# Altium schematic sheet STRWL-S02-V00-12VProtection.SchDoc: 12V Protected Input
size A3; SheetNumber: 2; SheetTotal: 7
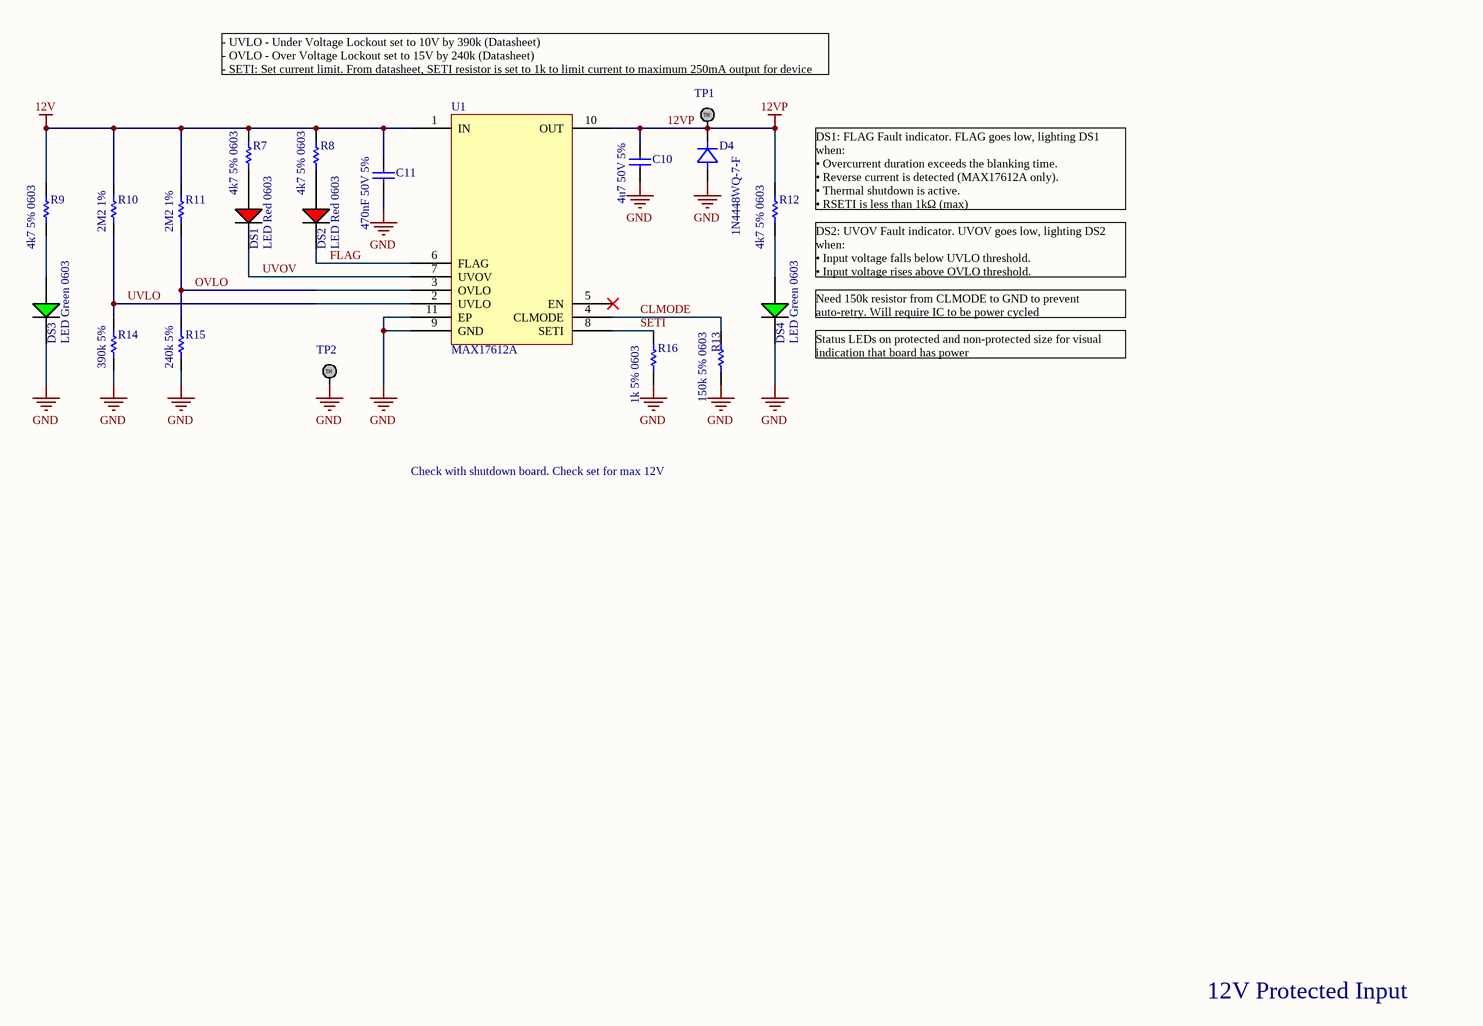
[diagram p0: STRWL-S02-V00-12VProtection.SchDoc]

## Parts
C10  4u7 50V 5%  [Cap_Ceramic_0603]
C11  470nF 50V 5%  [Cap_Ceramic_0603]
D4  1N4448WQ-7-F  [SMA]
DS1  LED Red 0603  [LED RED 0603]
DS2  LED Red 0603  [LED RED 0603]
DS3  LED Green 0603  [LED GREEN 0603]
DS4  LED Green 0603  [LED GREEN 0603]
R7  4k7 5% 0603  [Res_ThinFilm_0603]
R8  4k7 5% 0603  [Res_ThinFilm_0603]
R9  4k7 5% 0603  [Res_ThinFilm_0603]
R10  2M2 1%  [Res_ThinFilm_0603]
R11  2M2 1%  [Res_ThinFilm_0603]
R12  4k7 5% 0603  [Res_ThinFilm_0603]
R13  150k 5% 0603  [Res_ThinFilm_0603]
R14  390k 5%  [Res_ThinFilm_0603]
R15  240k 5%  [Res_ThinFilm_0603]
R16  1k 5% 0603  [Res_ThinFilm_0603]
TP1  TestPoint  [TestPointSMD]  (value not drawn)
TP2  TestPoint  [TestPointSMD]  (value not drawn)
U1  MAX17612A  [MAX17612A]

## Nets
12V: C11.2 R7.2 R8.2 R9.2 R10.2 R11.2 U1.1(IN)
12VP: C10.2 D4.K(Cathode) R12.2 TP1.1 U1.10(OUT)
GND: C10.1 C11.1 D4.A(Anode) DS3.2(C) DS4.2(C) R13.1 R14.1 R15.1 R16.1 TP2.1 U1.9(GND) U1.11(EP)
CLMODE: R13.2 U1.4(CLMODE)
FLAG: DS2.2(C) U1.6(FLAG)
OVLO: R11.1 R15.2 U1.3(OVLO)
SETI: R16.2 U1.8(SETI)
UVLO: R10.1 R14.2 U1.2(UVLO)
UVOV: DS1.2(C) U1.7(UVOV)
NetDS1_1: DS1.1(A) R7.1
NetDS2_1: DS2.1(A) R8.1
NetDS3_1: DS3.1(A) R9.1
NetDS4_1: DS4.1(A) R12.1

Not connected (* = marked no-connect by the designer): U1 5(EN)*

## Notes on the sheet
- - UVLO - Under Voltage Lockout set to 10V by 390k (Datasheet)
  - OVLO - Over Voltage Lockout set to 15V by 240k (Datasheet)
  - SETI: Set current limit. From datasheet, SETI resistor is set to 1k to limit current to maximum 250mA output for device
- (near R12) DS1: FLAG Fault indicator. FLAG goes low, lighting DS1 when:
  • Overcurrent duration exceeds the blanking time.
  • Reverse current is detected (MAX17612A only).
  • Thermal shutdown is active.
  • RSETI is less than 1kΩ (max)
- DS2: UVOV Fault indicator. UVOV goes low, lighting DS2 when:
  • Input voltage falls below UVLO threshold.
  • Input voltage rises above OVLO threshold.
- (near DS4) Need 150k resistor from CLMODE to GND to prevent auto-retry. Will require IC to be power cycled
- (near DS4) Status LEDs on protected and non-protected size for visual indication that board has power
- Check with shutdown board. Check set for max 12V
- 12V Protected Input
- (in symbol TestPoint) TH

## Library data of the parts
C10 = 4u7 50V 5% X7R 0603: Capacitor, Ceramic, SMD, 4u7, 50V, 5%, X7R, 0603
C11 = 470nF 50V 5% X7R 0603: Capacitor, Ceramic, SMD, 470nF, 50V, 5%, X7R, 0603
D4 = 1N4448WQ-7-F: Diode, SMD, 75V, 5%, 250mA, SOD123; Manufacturer: ON Semiconductor / Fairchild; Manufacturer Part Number: 1N914BWS; Average Rectified Current: 150mA; Element Configuration: Single; Forward Voltage: 1V; Max Reverse Leakage Current: 5uA; Power Dissipation: 200mW; Recovery Time: 4ns; Max Forward Surge Current (Ifsm): 4A; Parameter 1: *; Weight: 0.0276g; Category: Rectifier Diodes; Contact Plating: Tin,Matte; Forward Current: 150mA; Lead Free: Lead Free; Max Operating Temperature: 150°C; Max Repetitive Reverse Voltage (Vrrm): 75V; Max Reverse Voltage (DC): 75V; Min Operating Temperature: -55°C; Mount: Surface Mount; Number of Pins: 2; Package Quantity: 1; Packaging: Tape and Reel; Peak Reverse Current: 5uA; Radiation Hardening: No; REACH SVHC: No SVHC; Reverse Recovery Time: 4ns; Height: 1mm; Length: 1.8mm; Reverse Voltage: 75V; Width: 1.35mm
R7-R9 R12 = 4k7 5% 0603: Resistor, SMD, 4k7, 0.1W, 5%, 0603
R10 R11 = 2M2 1% 0603: Resistor, SMD, 2M2, 0.125W, 1%, 0603
R13 = 150k 5%, 0603: Resistor, SMD, 150k, 0.1W, 5%, 0603
R14 = 390k 5% 0603: Resistor, SMD, 390k, 0.1W, 5%, 0603
R15 = 240k 5% 0603: Resistor, SMD, 240k, 0.1W, 5%, 0603
R16 = 1k 5% 0603: Resistor, SMD, 1k, 0.1W, 5%, 0603
U1 = MAX17612A: 4.5V to 60V, 250mA Current-Limiter with OV, UV, and Reverse Protection; ComponentLink1Description: Datasheet; ComponentLink1URL: https://datasheets.maximintegrated.com/en/ds/MAX17612A-MAX17612C.pdf